# Altium schematic sheet Schematic Sheet1.SchDoc
size A4; PageSetup: Record=PageOptions|CenterHorizontal=True|CenterVertical=True|PrintScale=1.00|XCorrection=1.00|YCorrection=1.00|PrintKind=1|BorderSize=5000000|LeftOffset=0|BottomOffset=0|Orientation=2|PaperLength=1000|PaperWidth=1000|Scale=100|PaperSource=7|PrintQuality=600|MediaType=1|DitherType=10|PaperKind=A3|PrintScaleMode=1
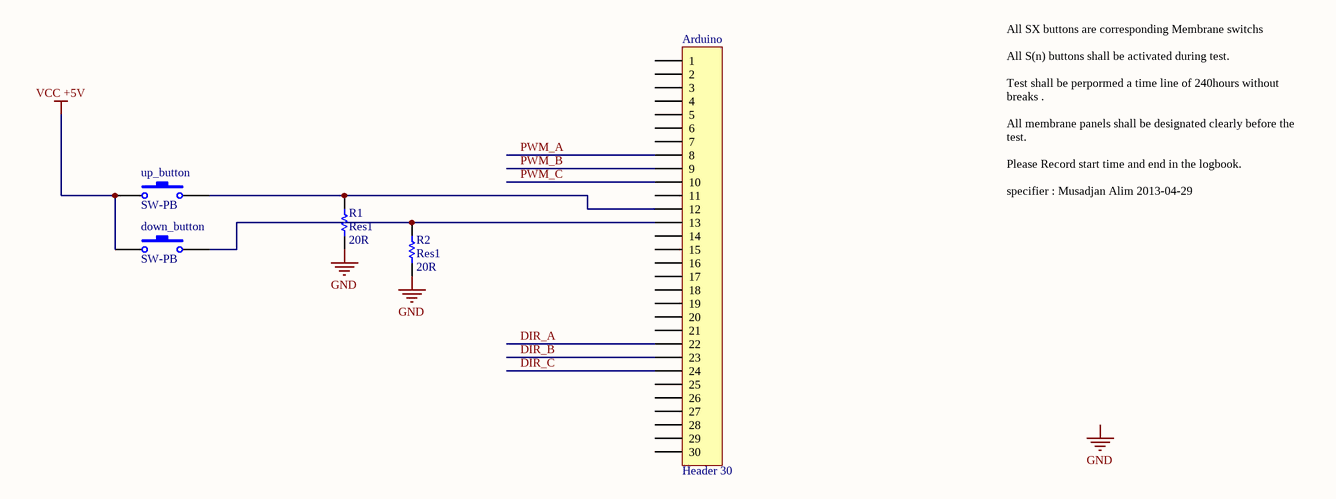
[diagram p0: Schematic Sheet1.SchDoc]

## Parts
Arduino  Header 30  [HDR1X30]
down_button  SW-PB  [SPST-2]
R1  Res1  value 20R  [AXIAL-0.3]
R2  Res1  value 20R  [AXIAL-0.3]
up_button  SW-PB  [SPST-2]

## Nets
GND: R1.1 R2.1
VCC +5V: down_button.1 up_button.1
DIR_A: Arduino.22
DIR_B: Arduino.23
DIR_C: Arduino.24
PWM_A: Arduino.8
PWM_B: Arduino.9
PWM_C: Arduino.10
NetArduino_12: Arduino.12 R1.2 up_button.2
NetArduino_13: Arduino.13 down_button.2 R2.2

Not connected (* = marked no-connect by the designer): Arduino 1 2 3 4 5 6 7 11 14 15 16 17 18 19 20 21 25 26 27 28 29 30

## Notes on the sheet
- All SX buttons are corresponding Membrane switchs
  All S(n) buttons shall be activated during test.
  Test shall be perpormed a time line of 240hours without  breaks .
  All membrane panels shall be designated clearly before the test.
  Please Record start time and end in the logbook.
  specifier : Musadjan Alim 2013-04-29
- Labels drawn without touching a wire or pin: GND

## Library data of the parts
Arduino = Header 30: Header, 30-Pin; LatestRevisionDate: 17-Jul-2002; LatestRevisionNote: Re-released for DXP Platform.; Publisher: Altium Limited
down_button up_button = SW-PB: Switch; Published: 24-Mar-1999; LatestRevisionDate: 17-Jul-2002; LatestRevisionNote: Re-released for DXP Platform.; PackageReference: SPST-2; Publisher: Altium Limited
R1 R2 = Res1: Resistor; Published: 8-Jun-2000; LatestRevisionDate: 17-Jul-2002; LatestRevisionNote: Re-released for DXP Platform.; PackageReference: AXIAL-0.3; Publisher: Altium Limited